# Altium schematic sheet Power.SchDoc: Power
size A4; Author: P.A.; CompanyName: STMicroelectronics; Organization: Microcontrollers Division; Address1: 12, Rue Jules HOROWITZ; Address2: 38019 Grenoble; Address3: FRANCE; DocumentNumber: MB1261; Revision: B.01; SheetNumber: 3; SheetTotal: 15; Project: STM32L496G-DISCO
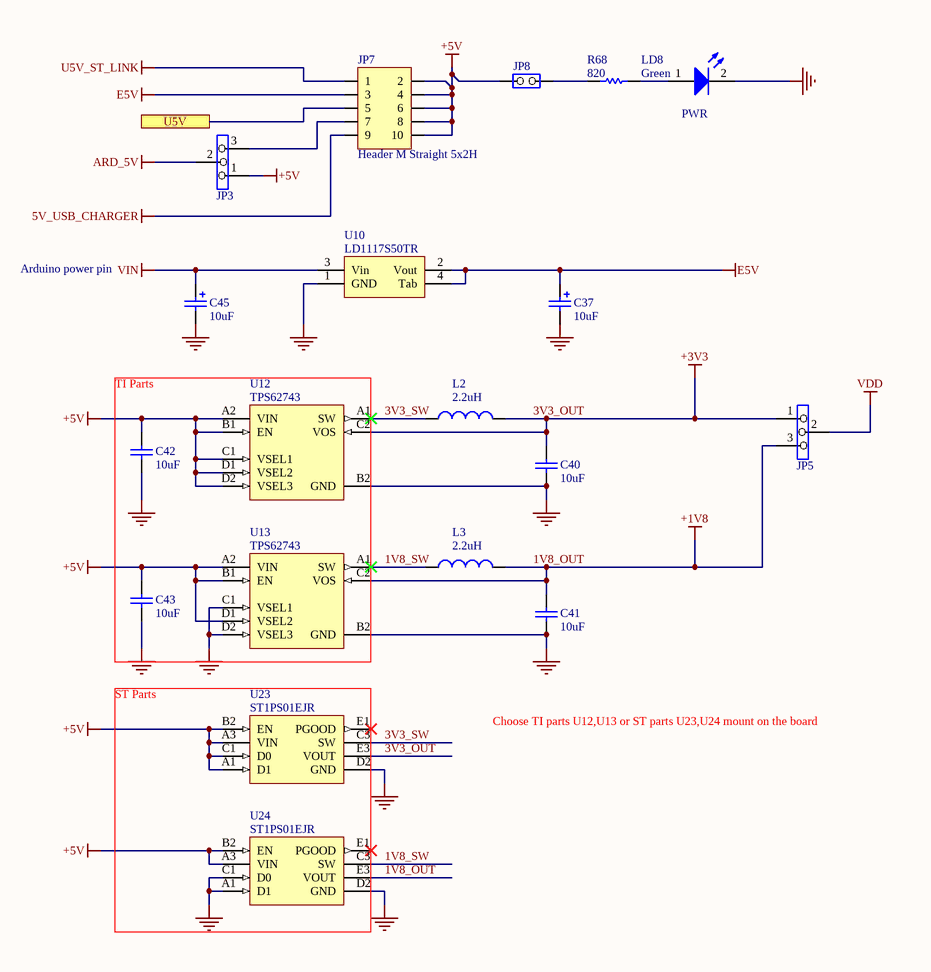
[diagram p0: Power.SchDoc]

## Parts
C37  value 10uF  [TAN-A]  (hidden comment: TAJA106K016R)
C40  value 10uF  [0402C]  (hidden comment: GRM155R60J106ME11)
C41  value 10uF  [0402C]  (hidden comment: GRM155R60J106ME11)
C42  value 10uF  [0402C]  (hidden comment: GRM155R60J106ME11)
C43  value 10uF  [0402C]  (hidden comment: GRM155R60J106ME11)
C45  value 10uF  [TAN-B]  (hidden comment: TAJB106K025RNJ)
JP3  3 PIN Jumper  [SIP3]  (value not drawn)
JP5  3 PIN Jumper  [SIP3]  (value not drawn)
JP7  Header M Straight 5x2H  [HDR_2X5_2R54]
JP8  2 PIN Jumper  [SIP2]  (value not drawn)
L2  2.2uH  [L1008_L0805_CPT]
L3  2.2uH  [L1008_L0805_CPT]
LD8  Silkscreen: PWR  Corlor: Green  [0603D]  (hidden comment: 19-213SY6C/S530-E2/TR8LED)
R68  820  [0603R]
U10  LD1117S50TR  [SOT-223]
U12  TPS62743  [BGA8_0R4_0R9X1R6]
U13  TPS62743  [BGA8_0R4_0R9X1R6]
U23  ST1PS01EJR  [BGA8_0R312-0R25_1R11X1R41]
U24  ST1PS01EJR  [BGA8_0R312-0R25_1R11X1R41]

## Blocks framed on the sheet
TI Parts: C42 C43 U12 U13
ST Parts: U23 U24

## Ports
U5V

## Nets
1V8_OUT: C41.1 JP5.3 L3.2 U13.C2(VOS) U24.E3(VOUT)  [also labelled +1V8]
3V3_OUT: C40.1 JP5.1 L2.2 U12.C2(VOS) U23.E3(VOUT)  [also labelled +3V3]
5V_USB_CHARGER: JP7.9
+5V: C42.1 C43.1 JP3.1 JP7.2 JP7.4 JP7.6 JP7.8 JP7.10 JP8.1(COMMON) U12.A2(VIN) U12.B1(EN) U12.C1(VSEL1) U12.D1(VSEL2) U12.D2(VSEL3) U13.A2(VIN) U13.B1(EN) U13.D1(VSEL2) U23.A1(D1) U23.A3(VIN) U23.B2(EN) U23.C1(D0) U24.A3(VIN) U24.B2(EN)
ARD_5V: JP3.2
E5V: C37.1 JP7.3 U10.2(Vout) U10.4(Tab)
GND: C37.2 C40.2 C41.2 C42.2 C43.2 C45.2 LD8.2(K) U10.1(GND) U12.B2(GND) U13.B2(GND) U13.C1(VSEL1) U13.D2(VSEL3) U23.D2(GND) U24.A1(D1) U24.C1(D0) U24.D2(GND)
U5V_ST_LINK: JP7.1
VDD: JP5.2
VIN: C45.1 U10.3(Vin)
1V8_SW: L3.1 U13.A1(SW) U24.C3(SW)
3V3_SW: L2.1 U12.A1(SW) U23.C3(SW)
U5V: JP7.5 ; port U5V
NetJP3_3: JP3.3 JP7.7
NetJP8_2: JP8.2(NO) R68.2
NetLD8_1: LD8.1(A) R68.1

Not connected (* = marked no-connect by the designer): U23 E1(PGOOD)*; U24 E1(PGOOD)*

## Notes on the sheet
- Arduino power pin
- Choose TI parts U12,U13 or ST parts U23,U24 mount on the board
- Title:
- Project:
- Size:
- Revision:
- Variant:
- A4
- -
- Date:
- Reference:
- Sheet:
- of

## Library data of the parts
C37 = Cap Pol1: TAN Capacitor,10uF,10%,16V,A Type,AVX; Ordered by: Subcon; ECCN_US/EU: NA; Published: 8-Jun-2000; Revision: July-2002: Re-released for DXP Platform.; Publisher: Altium Limited; Manuf_1: AVX; Manuf_Part_1: TAJA106K016R
C40-C43 = Cap: Capacitor,10uF,0402,GRM155R60J106ME11; Manuf_1: Murata; Ordered by: Subcon; Published: 8-Jun-2000; Revision: July-2002: Re-released for DXP Platform.; Publisher: Altium Limited; Manuf_Part_1: GRM155R60J106ME11
C45 = Cap Pol1: Tan Capacitor,10uF,10%,25V,Tan-B,TAJB106K025RNJ; Manuf_1: AVX; Ordered by: Subcon; ECCN_US/EU: NA; Published: 8-Jun-2000; Revision: July-2002: Re-released for DXP Platform.; Publisher: Altium Limited; Manuf_Part_1: TAJB106K025RNJ
JP3 JP5 = Jumper3: Manuf_1: lyconn; Manuf_Part_1: 313103S111116; Ordered by: Subcon; Silkscreen: +3V3: pins 1&2 +1V8: pins 2&3; ECCN_US/EU: NA
JP7 = Header 5X2M: Pin Header male,2.54mm,2*5,L=11.6,180,1U,DIP; Manuf_1: Lyconn; Ordered by: Subcon; Distrib: Sub Co; Footprint: HDR2X5H; ECCN_US/EU: n/a; SOFER_FP: HDR_2X5_2R54
JP8 = JP2: Manuf_1: lyconn; Manuf_Part_1: 313102S111116; Ordered by: Subcon; Assembly: with jumper; ECCN_US/EU: NA
L2 L3 = Inductor: Manuf_1: TDK; Manuf_Part_1: VLS252010HBX-2R2M-1; Ordered by: Subcon; ECCN_US/EU: NA; Published: 8-Jun-2000; Revision: July-2002: Re-released for DXP Platform.; Publisher: Altium Limited; Value: 2.2uH
LD8 = LED2: LED,Green,0603; Manuf_1: Everlight; Ordered by: Subcon; ECCN_US/EU: EAR99/NEC; Published: 8-Jun-2000; Revision: July-2002: Re-released for DXP Platform.; Publisher: Altium Limited; Manuf_Part_1: 19-213SY6C/S530-E2/TR8LED
R68 = res1: Resistor; Manuf_1: YAGEO; Manuf_Part_1: RC0603FR-07820RL; Ordered by: Subcon; ECCN_US/EU: NA; Published: 8-Jun-2000; Revision: July-2002: Re-released for DXP Platform.; Publisher: Altium Limited; Value: 820
U10 = LD1117S18TR: Adjustable and fixed low drop positive voltage regulator; Ordered by: STM; Manuf_1: STM; Manuf_Part_1: LD1117S50TR
U12 U13 = TPS62743: High Efficiency Buck Converter; Manuf_1: TI; Ordered by: Subcon; ECCN_US/EU: N/A; Manuf_Part_1: TPS62743
U23 = ST1PS01EJR: 400mA NanoQuiescent Step Down converter; Manuf_1: STM; Manuf_Part_1: ST1PS01EJR; Ordered by: STM
U24 = ST1PS01EJR: 400mA NanoQuiescent Step Down converter; Ordered by: STM; Manuf_1: STM; Manuf_Part_1: ST1PS01EJR